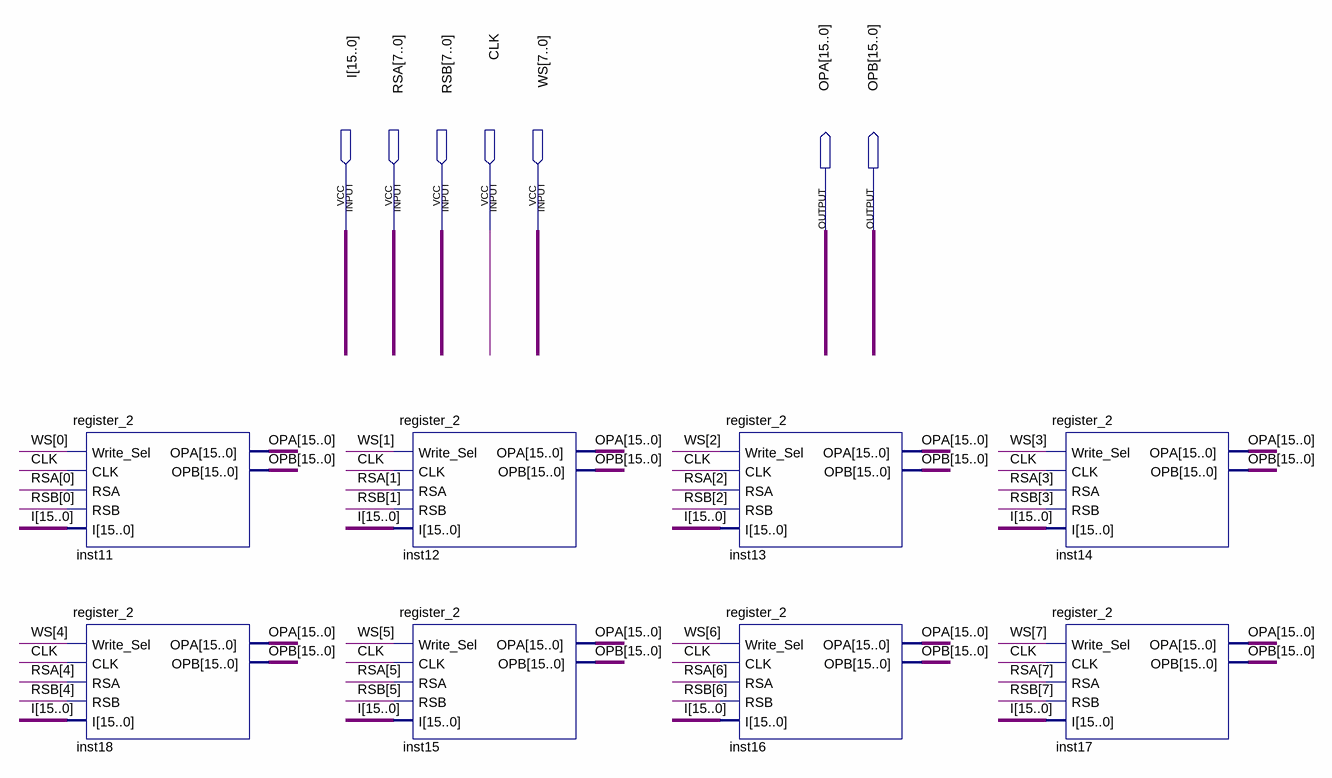
[diagram p0: schematic sheet]
// Quartus schematic registerfile_16x8.bdf as structural Verilog: 8 symbols, 7 pins
module registerfile_16x8 (
  input  [15:0] I,
  input  [7:0] RSA,
  input  [7:0] RSB,
  input  CLK,
  input  [7:0] WS,
  output [15:0] OPA,
  output [15:0] OPB
);

  register_2 inst11 (.Write_Sel(WS[0]), .CLK(CLK), .RSA(RSA[0]), .RSB(RSB[0]), .I(I), .OPA(OPA), .OPB(OPB));
  register_2 inst18 (.Write_Sel(WS[4]), .CLK(CLK), .RSA(RSA[4]), .RSB(RSB[4]), .I(I), .OPA(OPA), .OPB(OPB));
  register_2 inst12 (.Write_Sel(WS[1]), .CLK(CLK), .RSA(RSA[1]), .RSB(RSB[1]), .I(I), .OPA(OPA), .OPB(OPB));
  register_2 inst15 (.Write_Sel(WS[5]), .CLK(CLK), .RSA(RSA[5]), .RSB(RSB[5]), .I(I), .OPA(OPA), .OPB(OPB));
  register_2 inst13 (.Write_Sel(WS[2]), .CLK(CLK), .RSA(RSA[2]), .RSB(RSB[2]), .I(I), .OPA(OPA), .OPB(OPB));
  register_2 inst16 (.Write_Sel(WS[6]), .CLK(CLK), .RSA(RSA[6]), .RSB(RSB[6]), .I(I), .OPA(OPA), .OPB(OPB));
  register_2 inst14 (.Write_Sel(WS[3]), .CLK(CLK), .RSA(RSA[3]), .RSB(RSB[3]), .I(I), .OPA(OPA), .OPB(OPB));
  register_2 inst17 (.Write_Sel(WS[7]), .CLK(CLK), .RSA(RSA[7]), .RSB(RSB[7]), .I(I), .OPA(OPA), .OPB(OPB));
endmodule
